# EAGLE design PWM_v2_1 (EAGLE 9.6.2)
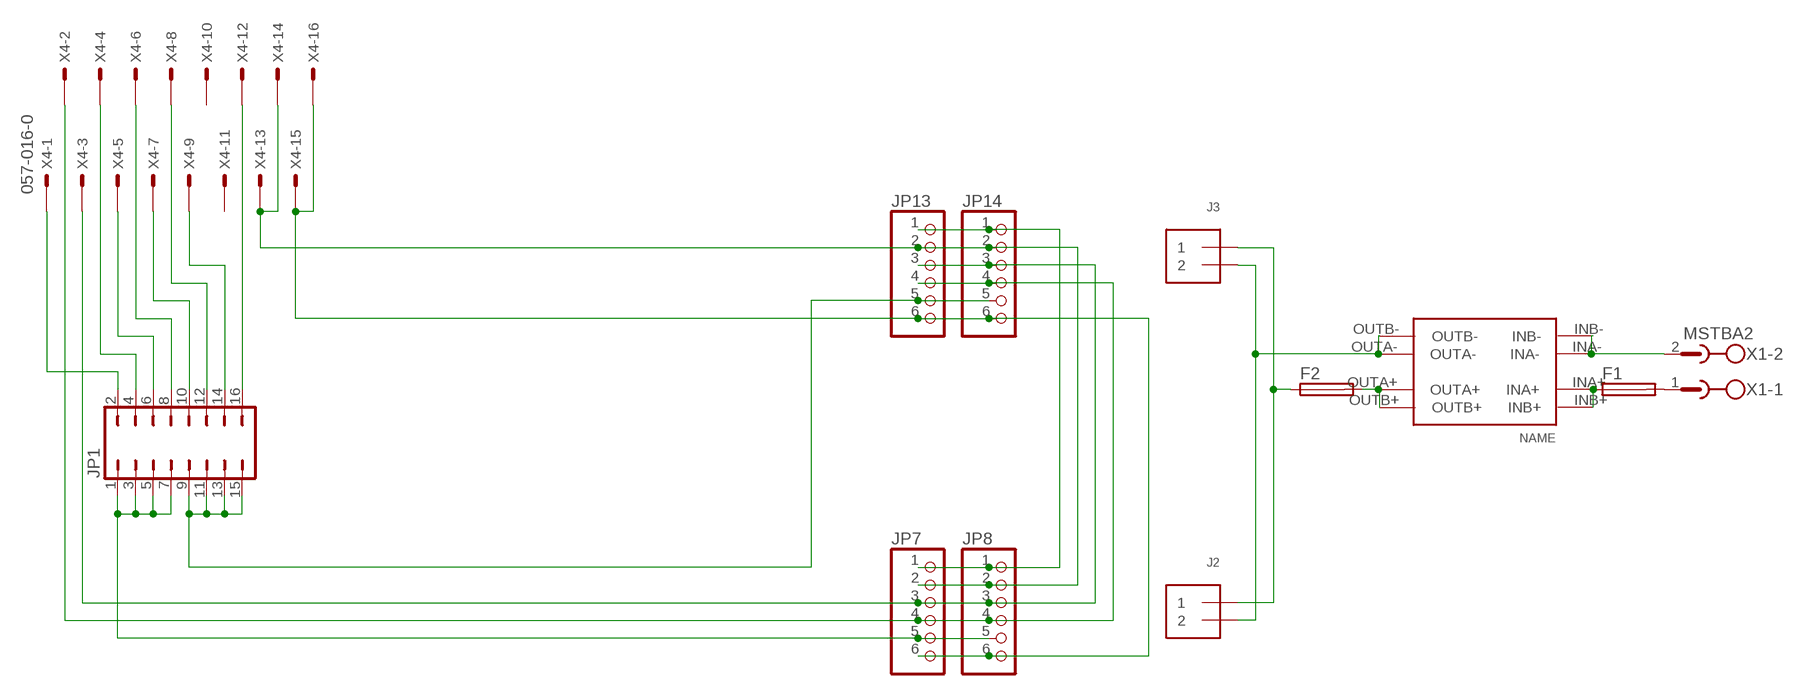
[diagram p0: schematic, sheet 1]

## Parts
F1  SH25  [SH25]
F2  SH25  [SH25]
J2  TERMBLOCK_1X2  [TERMBLOCK_1X2-3.5MM]
J3  TERMBLOCK_1X2  [TERMBLOCK_1X2-3.5MM]
JP1  JP8Q  [JP8Q]
JP7  PINHD-1X6CB  [1X06-CLEANBIG]
JP8  PINHD-1X6CB  [1X06-CLEANBIG]
JP13  PINHD-1X6CB  [1X06-CLEANBIG]
JP14  PINHD-1X6CB  [1X06-CLEANBIG]
U$2  CP8-ADJ-B  [CP8-ADJ-B]
X1  MSTBA2  [MSTBA2]
X4  057-016-0  [057-016-0]

## Nets
N$1: J2.2 J3.2 U$2.OUTA- U$2.OUTB-
N$2: F2.1 J2.1 J3.1
N$3: JP7.4 JP8.4 JP13.4 JP14.4 X4.2
N$4: JP1.2 X4.1
N$5: JP7.6 JP8.6 JP13.6 JP14.6 X4.15 X4.16
N$6: JP7.1 JP8.1 JP13.1 JP14.1
N$7: JP7.2 JP8.2 JP13.2 JP14.2 X4.13 X4.14
N$8: U$2.INA- U$2.INB- X1.2
N$9: F1.1 U$2.INA+ U$2.INB+
N$10: F1.2 X1.1
N$11: JP7.3 JP8.3 JP13.3 JP14.3 X4.3
N$12: F2.2 U$2.OUTA+ U$2.OUTB+
N$13: JP1.4 X4.4
N$14: JP1.1 JP1.3 JP1.5 JP1.7 JP7.5 JP8.5
N$15: JP1.9 JP1.11 JP1.13 JP1.15 JP13.5 JP14.5
N$16: JP1.6 X4.5
N$17: JP1.8 X4.6
N$18: JP1.10 X4.7
N$19: JP1.12 X4.8
N$20: JP1.16 X4.12
N$21: JP1.14 X4.9
Unconnected: X4.10 X4.11

## Library data of the parts
F1 F2 = fuse:SH25: FUSE HOLDER grid 25 mm, OGN0031 8211, Schurter (Buerklin); MF: SCHURTER; MPN: 0031.8211; OC_FARNELL: 1162741; OC_NEWARK: 96B9380
J2 J3 = microbuilder:TERMBLOCK_1X2: 3.5mm Terminal block http://www.ladyada.net/library/pcb/eaglelibrary.html
JP1 = jumper:JP8Q: JUMPER
JP7 JP8 JP13 JP14 = adafruit:PINHD-1X6: PIN HEADER
U$2 = userlib:CP8-ADJ-B: Voltage regulator IN: 7-35V OUT: ADJ
X1 = con-phoenix-508:MSTBA2: PHOENIX; MF: FARNELL; MPN: 1757242; OC_FARNELL: 3705171; OC_NEWARK: 71C4161
X4 = con-panduit:057-016-: CONNECTOR 10-pin series 057 contact pc board low profile headers; OC_FARNELL: unknown; OC_NEWARK: unknown

## Board
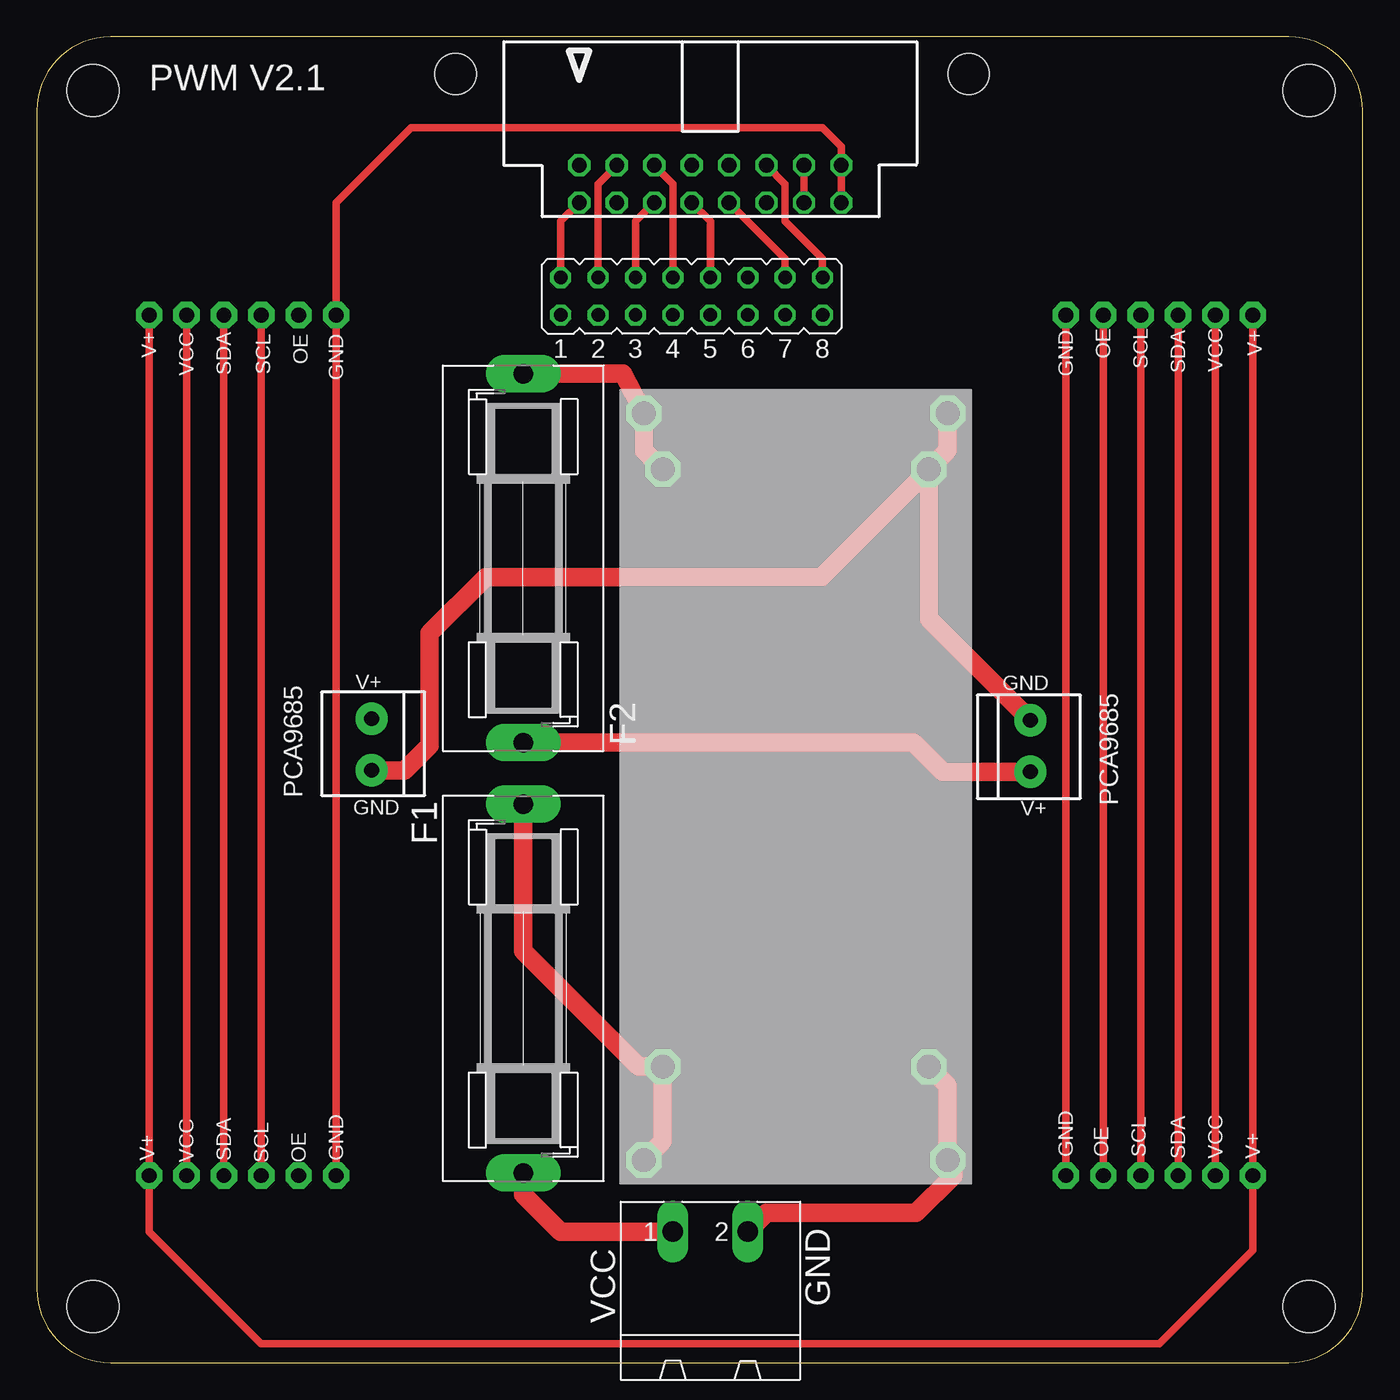
[diagram p1: board, top side]
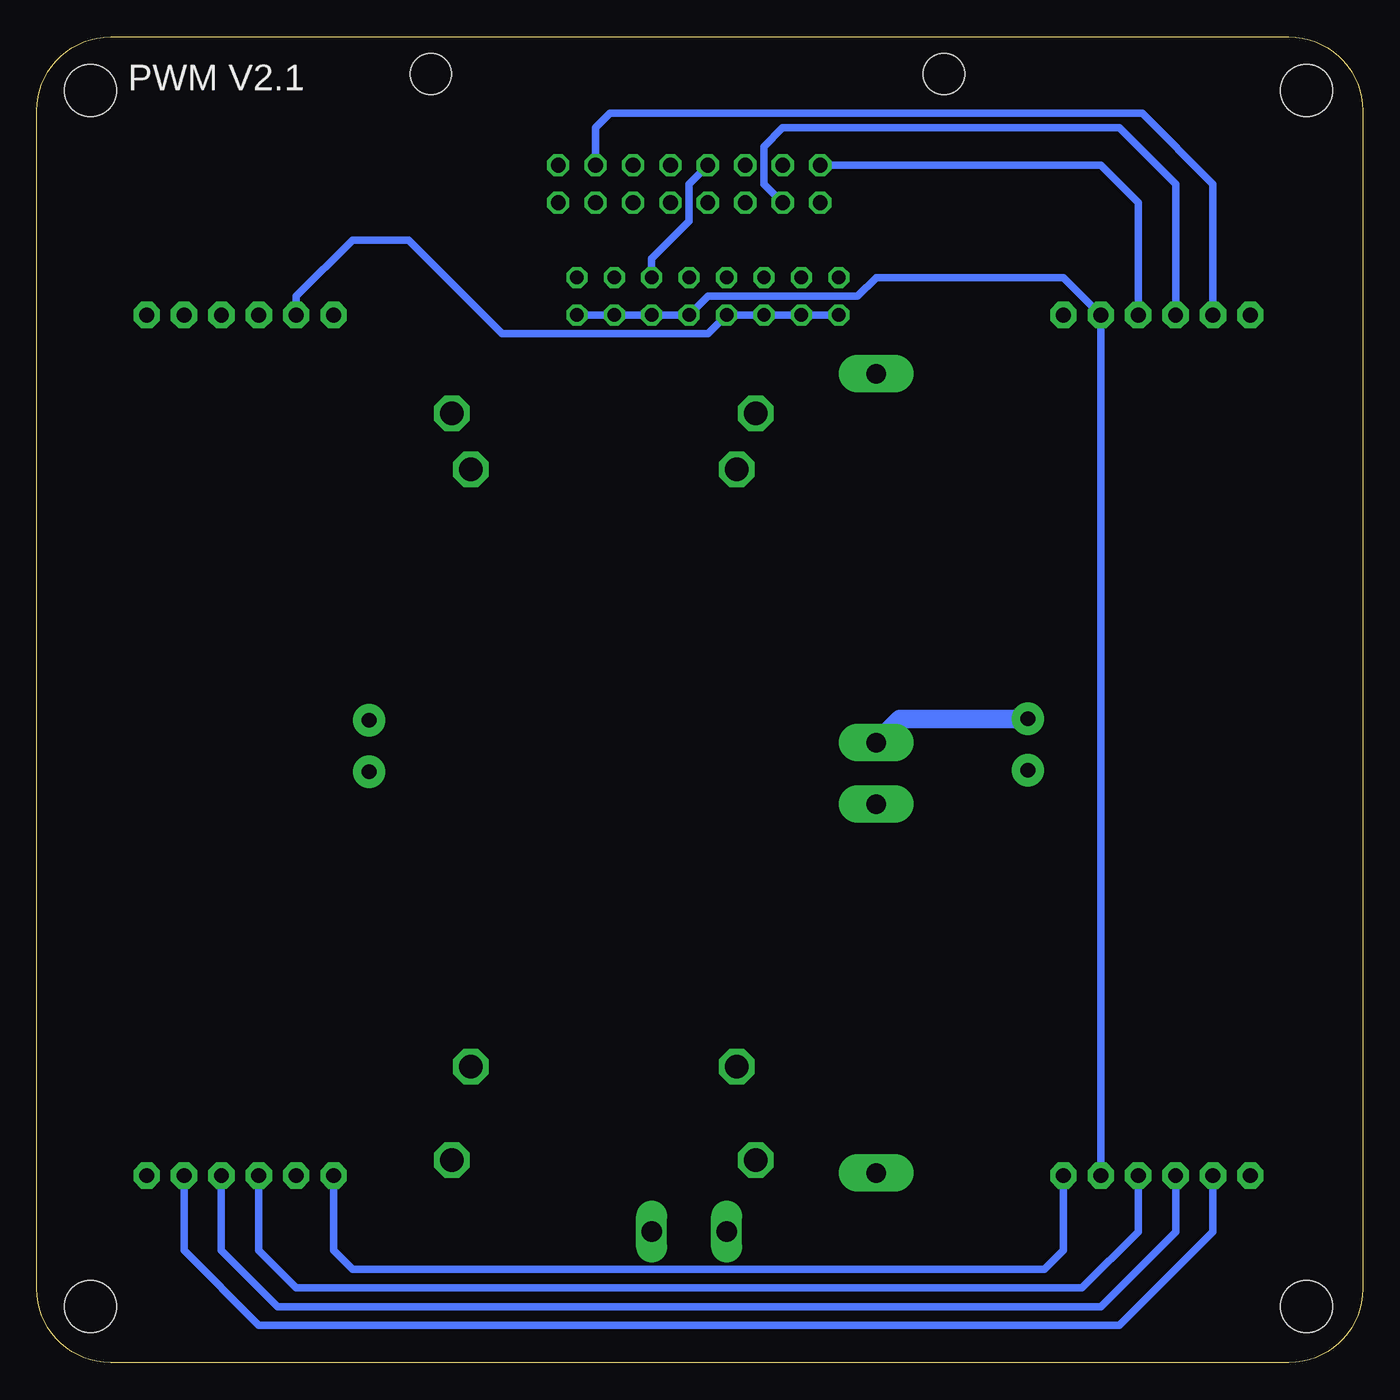
[diagram p2: board, bottom side, seen from below]

Size 90 x 90 mm. Coordinates in mm from the lower left corner, seen from the top.
Outline: 0,85 0,5 arc90 5,0 85,0 arc90 90,5 90,85 arc90 85,90 5,90 arc90 0,85
Copper layers (1*16): Top 0.035mm / dielectric 1.5mm / Bottom 0.035mm
Design rules "default": minimum track width 6mil, minimum drill 0.35mm, track to track 6mil, track to pad 6mil, pad to pad 6mil, via to via 6mil, smd to smd 6mil, copper to edge 40mil, drill to drill 6mil, minimum pad ring 10mil, minimum via ring 8mil, stop-mask expansion 4mil, vias tented up to drill 0mil, thermal gap 10mil
Holes 3.5 mm at 86.36,86.36 3.81,86.36 3.81,3.81 86.36,3.81

### Footprints (pad centres in the part's own frame; a part is rotated, then mirrored left to right if it is on the bottom)
SH25 = drill 1.321 pad 2.54 long: 1 -12.522,0; 2 12.522,0
TERMBLOCK_1X2-3.5MM = drill 1 pad 2.184: 1 1.8,0; 2 -1.7,0
JP8Q = drill 0.914 octagon: 1 -8.89,-1.27; 2 -8.89,1.27; 3 -6.35,-1.27; 4 -6.35,1.27; 5 -3.81,-1.27; 6 -3.81,1.27; 7 -1.27,-1.27; 8 -1.27,1.27; 9 1.27,-1.27; 10 1.27,1.27; 11 3.81,-1.27; 12 3.81,1.27; 13 6.35,-1.27; 14 6.35,1.27; 15 8.89,-1.27; 16 8.89,1.27
1X06-CLEANBIG = drill 1.016 pad 1.778 octagon: 1 -6.35,0; 2 -3.81,0; 3 -1.27,0; 4 1.27,0; 5 3.81,0; 6 6.35,0
CP8-ADJ-B = drill 1.6 octagon: INA+ -19.27,8.32; INA- -19.27,-9.75; INB+ -25.62,9.59; INB- -25.62,-11.02; OUTA+ 21.26,8.32; OUTA- 21.26,-9.75; OUTB+ 25.07,9.59; OUTB- 25.07,-11.02
MSTBA2 = drill 1.397 long: 1 -2.54,5.08; 2 2.54,5.08
057-016-0 = drill 1 octagon: 1 -8.89,-5.08; 2 -8.89,-2.54; 3 -6.35,-5.08; 4 -6.35,-2.54; 5 -3.81,-5.08; 6 -3.81,-2.54; 7 -1.27,-5.08; 8 -1.27,-2.54; 9 1.27,-5.08; 10 1.27,-2.54; 11 3.81,-5.08; 12 3.81,-2.54; 13 6.35,-5.08; 14 6.35,-2.54; 15 8.89,-5.08; 16 8.89,-2.54 | hole 2.8: -17.29,3.66; 17.54,3.66

### Placement (x,y rotation side)
F1  33.02,25.4 270 top
F2  33.02,54.61 90 top
J2  67.44,41.91 270 top
J3  22.73,41.91 90 top
JP1  44.45,72.39 0 top
JP7  76.2,12.7 180 top
JP8  76.2,71.12 180 top
JP13  13.97,71.12 0 top
JP14  13.97,12.7 0 top
U$2  50.8,39.37 90 top
X1  45.72,3.81 0 top
X4  45.72,83.82 0 top

### Tracks (layer width: path | path; a pad name or v marks a point on that pad's centre or on a via)
N$1
  Top 1.27: U$2.OUTB- 61.82,61.9 U$2.OUTA- | J2.2 60.55,50.5 U$2.OUTA- | U$2.OUTA- 53.26,53.34 30.48,53.34 26.67,49.53 26.67,41.91 24.97,40.21 J3.2
N$2
  Top 1.27: F2.1 59.51,42.09 61.49,40.11 J2.1
  Bottom 1.27: J3.1 31.4,43.71 F2.1
N$3
  Top 0.508: JP13.4 JP14.4 | JP7.4 JP8.4
  Bottom 0.508: X4.2 17.78,81.28 15.24,78.74 JP13.4 | JP14.4 15.24,8.89 19.05,5.08 72.39,5.08 74.93,7.62 JP7.4
N$4
  Top 0.508: X4.1 35.56,77.47 JP1.2
N$5
  Top 0.508: X4.15 X4.16 54.61,82.55 53.34,83.82 25.4,83.82 20.32,78.74 JP13.6 JP14.6 | JP8.6 JP7.6
  Bottom 0.508: JP7.6 69.85,7.62 68.58,6.35 21.59,6.35 20.32,7.62 JP14.6
N$6
  Top 0.508: JP13.1 JP14.1 7.62,8.89 15.24,1.27 76.2,1.27 82.55,7.62 JP7.1 JP8.1
N$7
  Top 0.508: X4.14 X4.13 | JP14.2 JP13.2 | JP7.2 JP8.2
  Bottom 0.508: JP13.2 10.16,80.01 14.96,84.81 51.08,84.81 52.07,83.82 X4.14 | JP14.2 10.16,8.89 16.51,2.54 74.93,2.54 80.01,7.62 JP7.2
N$8
  Top 1.27: X1.2 49.53,10.16 59.69,10.16 62.23,12.7 62.23,13.34 U$2.INB- 61.82,18.83 U$2.INA-
N$9
  Top 1.27: U$2.INB+ 42.48,15.02 U$2.INA+ 40.86,20.1 33.02,27.94 F1.1
N$10
  Top 1.27: X1.1 35.56,8.89 33.02,11.43 F1.2
N$11
  Top 0.508: JP14.3 JP13.3 | JP8.3 JP7.3
  Bottom 0.508: X4.3 40.64,80.01 40.64,82.55 39.37,83.82 16.51,83.82 12.7,80.01 JP13.3 | JP7.3 77.47,7.62 73.66,3.81 17.78,3.81 12.7,8.89 JP14.3
N$12
  Top 1.27: F2.2 39.79,67.13 U$2.OUTB+ 41.21,61.9 U$2.OUTA+
N$13
  Top 0.508: X4.4 38.1,80.01 JP1.4
N$14
  Top 0.508: JP8.5 JP7.5
  Bottom 0.508: JP1.1 JP1.3 JP1.5 JP1.7 44.45,69.85 58.42,69.85 64.77,76.2 68.58,76.2 72.39,72.39 JP8.5
N$15
  Bottom 0.508: JP1.15 JP1.13 JP1.11 JP1.9 44.45,72.39 34.29,72.39 33.02,73.66 20.32,73.66 JP13.5 JP14.5
N$16
  Top 0.508: X4.5 40.64,77.47 JP1.6
N$17
  Top 0.508: X4.6 43.18,80.01 JP1.8
N$18
  Top 0.508: X4.7 45.72,77.47 JP1.10
N$19
  Bottom 0.508: X4.8 45.72,80.01 45.72,77.47 48.26,74.93 JP1.12
N$20
  Top 0.508: X4.12 50.8,80.01 50.8,77.47 53.34,74.93 JP1.16
N$21
  Top 0.508: JP1.14 50.8,74.93 X4.9

### Text on the board
tPlace: V+ | VCC | SDA | SCL | OE | GND | GND | OE | SCL | SDA | VCC | V+ | GND | PCA9685 | V+ | V+ | PCA9685 | GND | V+ | VCC | SDA | SCL | OE | GND | GND | OE | SCL | SDA | VCC | V+ | VCC | GND
tNames: PWM V2.1
bNames: PWM V2.1